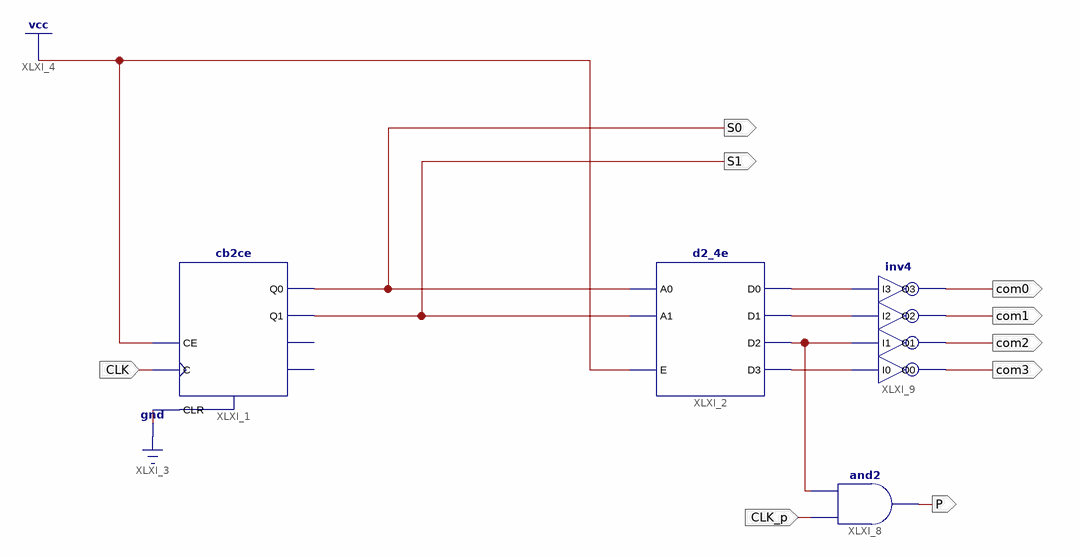
[diagram p0: schematic sheet 1]
// Xilinx ISE schematic Selecter2bit.sch (spartan6) as structural Verilog: 4 symbols, 9 ports
module Selecter2bit (
  input  CLK,
  input  CLK_p,
  output S0,
  output S1,
  output P,
  output com0,
  output com1,
  output com2,
  output com3
);

  wire XLXN_8, XLXN_10, XLXN_11, XLXN_16;

  cb2ce XLXI_1 (.C(CLK), .CE(1'b1), .CLR(1'b0), .Q0(S0), .Q1(S1));  // open: CEO, TC
  d2_4e XLXI_2 (.A0(S0), .A1(S1), .E(1'b1), .D0(XLXN_11), .D1(XLXN_10), .D2(XLXN_16), .D3(XLXN_8));
  and XLXI_8 (P, CLK_p, XLXN_16);
  inv4 XLXI_9 (.I0(XLXN_8), .I1(XLXN_16), .I2(XLXN_10), .I3(XLXN_11), .O0(com3), .O1(com2), .O2(com1), .O3(com0));
endmodule
